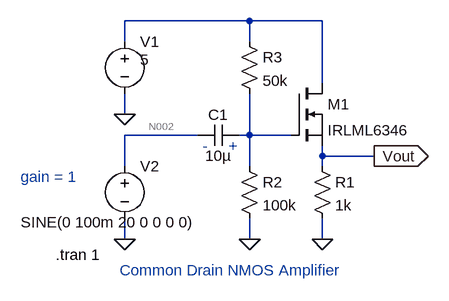
[diagram p0: schematic Draft1.asc]
Draft1.asc, the LTspice schematic file:
Version 4
SHEET 1 880 680
WIRE 32 -32 -160 -32
WIRE 144 -32 32 -32
WIRE -160 0 -160 -32
WIRE 32 0 32 -32
WIRE 144 64 144 -32
WIRE -160 112 -160 80
WIRE -48 144 -160 144
WIRE 32 144 32 80
WIRE 32 144 16 144
WIRE 96 144 32 144
WIRE 144 176 144 160
WIRE 224 176 144 176
WIRE -160 192 -160 144
WIRE 32 192 32 144
WIRE 144 192 144 176
WIRE -160 304 -160 272
WIRE 32 304 32 272
WIRE 144 304 144 272
FLAG -160 112 0
FLAG 32 304 0
FLAG 144 304 0
FLAG 224 176 Vout
IOPIN 224 176 Out
FLAG -160 304 0
SYMBOL voltage -160 -16 R0
WINDOW 3 24 44 Left 2
WINDOW 123 0 0 Left 0
WINDOW 39 0 0 Left 0
SYMATTR InstName V1
SYMATTR Value 5
SYMBOL nmos 96 64 R0
SYMATTR InstName M1
SYMATTR Value IRLML6346
SYMBOL res 128 176 R0
SYMATTR InstName R1
SYMATTR Value 1k
SYMBOL res 16 176 R0
SYMATTR InstName R2
SYMATTR Value 100k
SYMBOL res 16 -16 R0
SYMATTR InstName R3
SYMATTR Value 50k
SYMBOL cap 16 128 R90
WINDOW 0 0 32 VBottom 2
WINDOW 3 32 32 VTop 2
SYMATTR InstName C1
SYMATTR Value 10µ
SYMBOL voltage -160 176 R0
WINDOW 3 -160 102 Left 2
WINDOW 123 0 0 Left 0
WINDOW 39 0 0 Left 0
SYMATTR InstName V2
SYMATTR Value SINE(0 100m 20 0 0 0 0)
TEXT 0 160 Left 2 ;+
TEXT -40 160 Left 2 ;-
TEXT -266 328 Left 2 !.tran 1
TEXT -320 208 Left 2 ;gain = 1
TEXT -168 352 Left 2 ;Common Drain NMOS Amplifier

The netlist it stands for:
* Draft1.asc
V1 N001 0 5
M1 N001 N003 Vout Vout IRLML6346
R1 Vout 0 1k
R2 N003 0 100k
R3 N001 N003 50k
C1 N003 N002 10µ
V2 N002 0 SINE(0 100m 20 0 0 0 0)
.model NMOS NMOS
.model PMOS PMOS
.lib standard.mos
* +
* -
.tran 1
* gain = 1
* Common Drain NMOS Amplifier
.backanno
.end

* Results of the author's LTspice run, read from the files saved beside the schematic
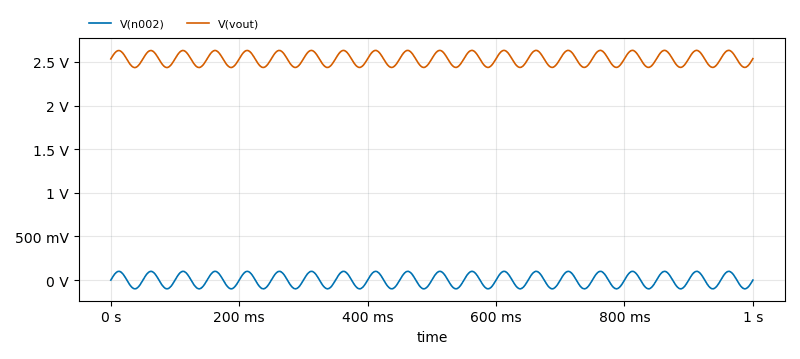
[diagram p1: Transient Analysis of Draft1.asc, plotted from the saved traces]
* Transient Analysis, 1 run:
*   V(n002): min -100 mV, max 100 mV, average 38.68 nV, rms 70.74 mV, last 0 V
*   V(vout): min 2.436 V, max 2.633 V, average 2.535 V, rms 2.536 V, last 2.538 V